# Altium schematic sheet 15_PowerSupply.SchDoc: Board power supply (part 1 of 3)
size A3; Organization: Lime Microsystems; Address1: Surrey Tech Centre; Address2: Guildford GU2 7YG; Address3: Surrey; Address4: United Kingdom; Revision: v2.1; SheetNumber: 15; SheetTotal: 15
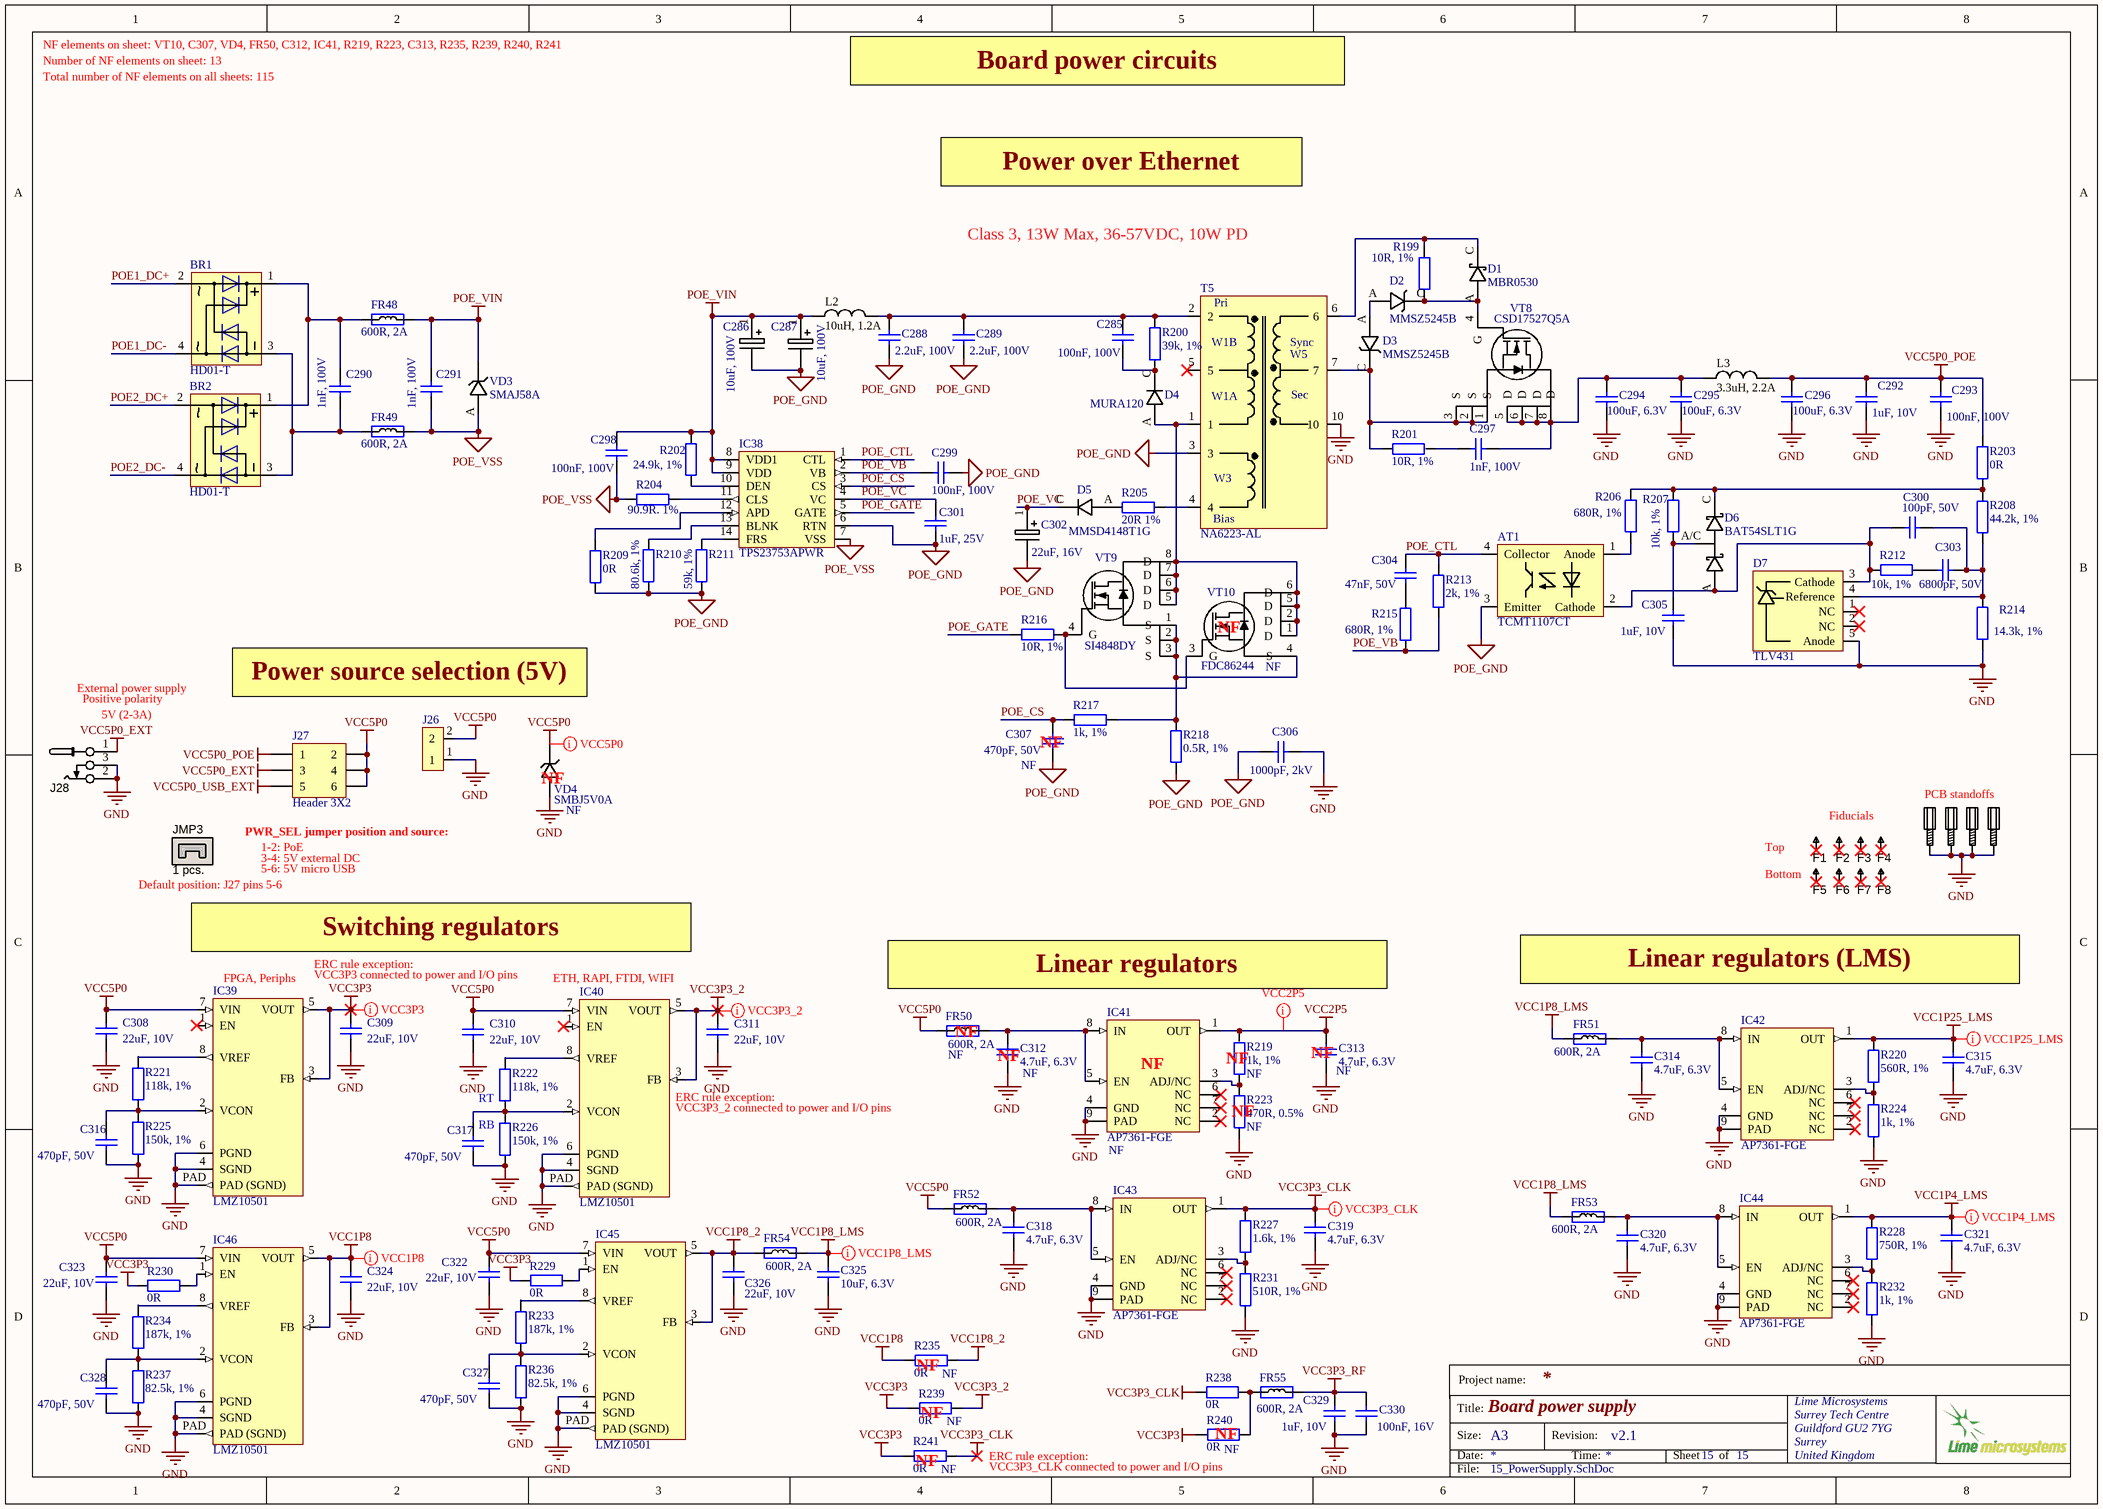
[diagram p0: 15_PowerSupply.SchDoc]

## Parts
AT1  TCMT1107CT  [TCMT1107CT_optoisolator]
BR1  HD01-T  [HD01-T _RECTIFIER_BRIDGE_v1]
BR2  HD01-T  [HD01-T _RECTIFIER_BRIDGE_v1]
C285  100nF, 100V  [CAP0603]
C286  10uF, 100V  [CAP_POL_SIZE_E]
C287  10uF, 100V  [CAP_POL_SIZE_E]
C288  2.2uF, 100V  [CAP1206]
C289  2.2uF, 100V  [CAP1206]
C290  1nF, 100V  [CAP0603]
C291  1nF, 100V  [CAP0603]
C292  1uF, 10V  [CAP0402]
C293  100nF, 100V  [CAP0603]
C294  100uF, 6.3V  [CAP1210]
C295  100uF, 6.3V  [CAP1210]
C296  100uF, 6.3V  [CAP1210]
C297  1nF, 100V  [CAP0603]
C298  100nF, 100V  [CAP0603]
C299  100nF, 100V  [CAP0603]
C300  100pF, 50V  [CAP0402]
C301  1uF, 25V  [CAP0603]
C302  22uF, 16V  [CAP_POL_SIZE_B]
C303  6800pF, 50V  [CAP0402]
C304  47nF, 50V  [CAP0603]
C305  1uF, 10V  [CAP0402]
C306  1000pF, 2kV  [CAP1812]
C307  470pF, 50V  Assembly Info: NF  [CAP0402]
C308  22uF, 10V  [CAP0603]
C309  22uF, 10V  [CAP0603]
C310  22uF, 10V  [CAP0603]
C311  22uF, 10V  [CAP0603]
C312  4.7uF, 6.3V  Assembly Info: NF  [CAP0402]
C313  4.7uF, 6.3V  Assembly Info: NF  [CAP0402]
C314  4.7uF, 6.3V  [CAP0402]
C315  4.7uF, 6.3V  [CAP0402]
C316  470pF, 50V  [CAP0402]
C317  470pF, 50V  [CAP0402]
C318  4.7uF, 6.3V  [CAP0402]
C319  4.7uF, 6.3V  [CAP0402]
C320  4.7uF, 6.3V  [CAP0402]
C321  4.7uF, 6.3V  [CAP0402]
C322  22uF, 10V  [CAP0603]
C323  22uF, 10V  [CAP0603]
C324  22uF, 10V  [CAP0603]
C325  10uF, 6.3V  [CAP0603]
C326  22uF, 10V  [CAP0603]
C327  470pF, 50V  [CAP0402]
C328  470pF, 50V  [CAP0402]
C329  1uF, 10V  [CAP0402]
C330  100nF, 16V  [CAP0402]
D1  MBR0530  [MBR0530T1G_shottky_diode_SOD123]
D2  MMSZ5245B  [MMSZ5245B_shottky_diode_SOD123]
D3  MMSZ5245B  [MMSZ5245B_shottky_diode_SOD123]
D4  MURA120  [MURA120T3G_diode_DO-214AC]
D5  MMSD4148T1G  [MMSD4148T1G_diode_SOD123]
D6  BAT54SLT1G  [BAT54SLT1G_SOT23-3]
D7  TLV431  [SOT23-5]
F1  Fiducial  [Fiducial]  (value not drawn)
F2  Fiducial  [Fiducial]  (value not drawn)
F3  Fiducial  [Fiducial]  (value not drawn)
F4  Fiducial  [Fiducial]  (value not drawn)
F5  Fiducial  [Fiducial]  (value not drawn)
F6  Fiducial  [Fiducial]  (value not drawn)
F7  Fiducial  [Fiducial]  (value not drawn)
F8  Fiducial  [Fiducial]  (value not drawn)
FR48  600R, 2A  [RES0805]
FR49  600R, 2A  [RES0805]
FR50  600R, 2A  Assembly Info: NF  [RES0805]
FR51  600R, 2A  [RES0805]
FR52  600R, 2A  [RES0805]
FR53  600R, 2A  [RES0805]
FR54  600R, 2A  [RES0805]
FR55  600R, 2A  [RES0805]
IC38  TPS23753APWR  [TPS23753APWR _TSSOP14]
IC39  LMZ10501  [LMZ10501]
IC40  LMZ10501  [LMZ10501]
IC41  AP7361-FGE  Assembly Info: NF  [AP7361]
IC42  AP7361-FGE  [AP7361]
IC43  AP7361-FGE  [AP7361]
IC44  AP7361-FGE  [AP7361]
IC45  LMZ10501  [LMZ10501]
IC46  LMZ10501  [LMZ10501]
J26  (no value)  [HDR_1x2]
J27  Header 3X2  [Header3x2]
J28  CONN_PWR_JACK_2.1x5.5mm  [CONN_PWR_JACK_v2]  (value not drawn)
JMP3  1 pcs.  (mechanical)
L2  10uH, 1.2A  [NRS4018T3R3MDGJ_inductor]
L3  3.3uH, 2.2A  [NRS4018T3R3MDGJ_inductor]
MECH5  # pcs.  [PCB_standoff]  (value not drawn)
MECH6  # pcs.  [PCB_standoff]  (value not drawn)
MECH7  # pcs.  [PCB_standoff]  (value not drawn)
MECH8  # pcs.  [PCB_standoff]  (value not drawn)
R199  10R, 1%  [RES0603]
R200  39k, 1%  [RES0805]
R201  10R, 1%  [RES0805]
R202  24.9k, 1%  [RES0402]
R203  0R  [RES0402]
R204  90.9R. 1%  [RES0603]
R205  20R 1%  [RES0805]
R206  680R, 1%  [RES0402]
R207  10k, 1%  [RES0402]
R208  44.2k, 1%  [RES0402]
R209  0R  [RES0402]
R210  80.6k, 1%  [RES0402]
R211  59k, 1%  [RES0402]
R212  10k, 1%  [RES0402]
R213  2k, 1%  [RES0402]
R214  14.3k, 1%  [RES0402]
R215  680R, 1%  [RES0402]
R216  10R, 1%  [RES0603]
R217  1k, 1%  [RES0402]
R218  0.5R, 1%  [RES1206]
R219  1k, 1%  Assembly Info: NF  [RES0402]
R220  560R, 1%  [RES0402]
R221  118k, 1%  [RES0402]
R222  118k, 1%  [RES0402]
R223  470R, 0.5%  Assembly Info: NF  [RES0402]
R224  1k, 1%  [RES0402]
R225  150k, 1%  [RES0402]
R226  150k, 1%  [RES0402]
R227  1.6k, 1%  [RES0402]
R228  750R, 1%  [RES0402]
R229  0R  [RES0402]
R230  0R  [RES0402]
R231  510R, 1%  [RES0402]
R232  1k, 1%  [RES0402]
R233  187k, 1%  [RES0402]
R234  187k, 1%  [RES0402]
R235  0R  Assembly Info: NF  [RES0805]
R236  82.5k, 1%  [RES0402]
R237  82.5k, 1%  [RES0402]
R238  0R  [RES0402]
R239  0R  Assembly Info: NF  [RES0805]
R240  0R  Assembly Info: NF  [RES0402]
R241  0R  Assembly Info: NF  [RES0805]
T5  NA6223-AL  [PoE13P-50L_Flyback_transformer]
VD3  SMAJ58A  [SMAJ58A_shottky_diode]
VD4  SMBJ5V0A  Assembly Info: NF  [SMAJ12CA-13-F]
VT8  CSD17527Q5A  [CSD17527Q5A_NMOS_8-VSONP]
VT9  SI4848DY  [SI4848DY_NMOS_SO8]
VT10  FDC86244  Assembly Info: NF  [SOT23-6]

## Nets
GND: C292.1 C293.1 C294.1 C295.1 C296.1 C305.1 C306.1 C308.1 C309.1 C310.1 C311.1 C312.1 C313.1 C314.1 C315.1 C316.2 C317.2 C318.1 C319.1 C320.1 C321.1 C322.1 C323.1 C324.1 C325.1 C326.1 C327.2 C328.2 C329.1 C330.2 D7.5(Anode) IC39.4(SGND) IC39.6(PGND) IC39.PAD(PAD_(SGND)) IC40.4(SGND) IC40.6(PGND) IC40.PAD(PAD_(SGND)) IC41.4(GND) IC41.9(PAD) IC42.4(GND) IC42.9(PAD) IC43.4(GND) IC43.9(PAD) IC44.4(GND) IC44.9(PAD) IC45.4(SGND) IC45.6(PGND) IC45.PAD(PAD_(SGND)) IC46.4(SGND) IC46.6(PGND) IC46.PAD(PAD_(SGND)) J26.1 J28.2 J28.3 MECH5.MH1 MECH6.MH1 MECH7.MH1 MECH8.MH1 R214.2 R223.2 R224.1 R225.1 R226.1 R231.2 R232.1 R236.1 R237.1 T5.10 VD4.A
POE_GND: AT1.3(Emitter) C286.2 C287.2 C288.1 C289.1 C299.1 C301.1 C302.2 C306.2 C307.2 IC38.6(RTN) R209.1 R210.2 R211.2 R218.2 T5.3
POE_VIN: C286.1 C287.1 C291.1 C298.2 FR48.2 IC38.8(VDD1) IC38.9(VDD) L2.1 R202.2 VD3.K
POE_VSS: C291.2 C298.1 FR49.2 IC38.7(VSS) R204.2 VD3.A
VCC1P4_LMS: C321.2 IC44.1(OUT) R228.1
VCC1P8: C324.2 IC46.3(FB) IC46.5(VOUT) R235.2
VCC1P8_2: C326.2 FR54.1 IC45.3(FB) IC45.5(VOUT) R235.1
VCC1P8_LMS: C325.2 FR51.1 FR53.1 FR54.2
VCC1P25_LMS: C315.2 IC42.1(OUT) R220.2
VCC2P5: C313.2 IC41.1(OUT) R219.2
VCC3P3: C309.2 IC39.3(FB) IC39.5(VOUT) R229.1 R230.1 R239.2 R240.2 R241.2
VCC3P3_2: C311.2 IC40.3(FB) IC40.5(VOUT) R239.1
VCC3P3_CLK: C319.2 IC43.1(OUT) R227.2 R238.1 R241.1
VCC3P3_RF: C329.2 C330.1 FR55.2
VCC5P0: C308.2 C310.2 C322.2 C323.2 FR50.1 FR52.1 IC39.7(VIN) IC40.7(VIN) IC45.7(VIN) IC46.7(VIN) J26.2 J27.2 J27.4 J27.6 VD4.K
VCC5P0_EXT: J27.3 J28.1
VCC5P0_POE: C292.2 C293.2 C296.2 J27.1 L3.2 R203.2
VCC5P0_USB_EXT: J27.5
POE1_DC+: BR1.2
POE1_DC-: BR1.4
POE2_DC+: BR2.2
POE2_DC-: BR2.4
POE_CS: C307.1 IC38.3(CS) R217.1
POE_CTL: AT1.4(Collector) C304.1 IC38.1(CTL) R213.2
POE_GATE: IC38.5(GATE) R216.2
POE_VB: C299.2 IC38.2(VB) R213.1 R215.1
POE_VC: C301.2 C302.1 D5.C IC38.4(VC)
NetAT1_1: AT1.1(Anode) R206.2
NetAT1_2: AT1.2(Cathode) C300.2 D6.A D7.3(Cathode) R212.1
NetBR1_1: BR1.1 BR2.1 C290.1 FR48.1
NetBR1_3: BR1.3 BR2.3 C290.2 FR49.1
NetC285_1: C285.1 D4.C R200.1
NetC285_2: C285.2 C288.2 C289.2 L2.2 R200.2 T5.2
NetC294_2: C294.2 C295.2 C297.1 L3.1 VT8.5(D) VT8.6(D) VT8.7(D) VT8.8(D)
NetC297_2: C297.2 R201.2
NetC300_1: C300.1 C303.1 D7.4(Reference) R208.1 R214.1
NetC303_2: C303.2 R212.2
NetC304_2: C304.2 R215.2
NetC305_2: C305.2 D6.A/C R207.2
NetC312_2: C312.2 FR50.2 IC41.5(EN) IC41.8(IN)
NetC314_2: C314.2 FR51.2 IC42.5(EN) IC42.8(IN)
NetC316_1: C316.1 IC39.2(VCON) R221.1 R225.2
NetC317_1: C317.1 IC40.2(VCON) R222.1 R226.2
NetC318_2: C318.2 FR52.2 IC43.5(EN) IC43.8(IN)
NetC320_2: C320.2 FR53.2 IC44.5(EN) IC44.8(IN)
NetC327_1: C327.1 IC45.2(VCON) R233.1 R236.2
NetC328_1: C328.1 IC46.2(VCON) R234.1 R237.2
NetD1_A: D1.A D2.C R199.1 VT8.4(G)
NetD1_C: D1.C R199.2 T5.6
NetD2_A: D2.A D3.A
NetD3_C: D3.C R201.1 T5.7 VT8.1(S) VT8.2(S) VT8.3(S)
NetD4_A: D4.A T5.1 VT9.5(D) VT9.6(D) VT9.7(D) VT9.8(D) VT10.1(D) VT10.2(D) VT10.5(D) VT10.6(D)
NetD5_A: D5.A R205.1
NetD6_C: D6.C R203.1 R206.1 R207.1 R208.2
NetFR55_1: FR55.1 R238.2 R240.1
NetIC38_10: IC38.10(DEN) R202.1
NetIC38_11: IC38.11(CLS) R204.1
NetIC38_12: IC38.12(APD) R209.2
NetIC38_13: IC38.13(BLNK) R210.1
NetIC38_14: IC38.14(FRS) R211.1
NetIC39_8: IC39.8(VREF) R221.2
NetIC40_8: IC40.8(VREF) R222.2
NetIC41_3: IC41.3(ADJ/NC) R219.1 R223.1
NetIC42_3: IC42.3(ADJ/NC) R220.1 R224.2
NetIC43_3: IC43.3(ADJ/NC) R227.1 R231.1
NetIC44_3: IC44.3(ADJ/NC) R228.2 R232.2
NetIC45_1: IC45.1(EN) R229.2
NetIC45_8: IC45.8(VREF) R233.2
NetIC46_1: IC46.1(EN) R230.2
NetIC46_8: IC46.8(VREF) R234.2
NetR205_2: R205.2 T5.4
NetR216_1: R216.1 VT9.4(G) VT10.3(G)
NetR217_2: R217.2 R218.1 VT9.1(S) VT9.2(S) VT9.3(S) VT10.4(S)

Not connected (* = marked no-connect by the designer): D7 1(NC)* 2(NC)*; F1 1*; F2 1*; F3 1*; F4 1*; F5 1*; F6 1*; F7 1*; F8 1*; IC39 1(EN)*; IC40 1(EN)*; IC41 2(NC)* 6(NC)* 7(NC)*; IC42 2(NC)* 6(NC)* 7(NC)*; IC43 2(NC)* 6(NC)* 7(NC)*; IC44 2(NC)* 6(NC)* 7(NC)*; JMP3 1 2; T5 5*

## Layout directives
net class VCC1P4_LMS: VCC1P4_LMS
net class VCC1P25_LMS: VCC1P25_LMS
net class VCC3P3_CLK: VCC3P3_CLK
net class VCC2P5: VCC2P5
net class VCC3P3_2: VCC3P3_2
net class VCC3P3: VCC3P3
net class VCC1P8: VCC1P8
net class VCC5P0: VCC5P0
net class VCC1P8_LMS: VCC1P8_LMS

## Notes on the sheet
- NF elements on sheet: VT10, C307, VD4, FR50, C312, IC41, R219, R223, C313, R235, R239, R240, R241
- Number of NF elements on sheet: 13
- Total number of NF elements on all sheets: 115
- Board power circuits
- Power over Ethernet
- Class 3, 13W Max, 36-57VDC, 10W PD
- IEEE 802.3-2005 compliant
- 5V, 2A
- (near IC38) 250kHz
- (near VT10) NF
- External power supply
- (near J28) Positive polarity
- (near J28) 5V (2-3A)
- Power source selection (5V)
- (near VD4) NF
- (near C307) NF
- PWR_SEL jumper position and source:
- 1-2: PoE
- Top
- Fiducials
- PCB standoffs
- (near JMP3) Default position: J27 pins 5-6
- 3-4: 5V external DC
- 5-6: 5V micro USB
- (near F5) Bottom
- Switching regulators
- (near IC39) FPGA, Periphs
- ERC rule exception:
- VCC3P3 connected to power and I/O pins
- (near IC40) ETH, RAPI, FTDI, WIFI
- Linear regulators
- Linear regulators (LMS)
- (near FR50) NF
- (near C313) NF
- RT
- (near IC40) ERC rule exception:
- (near IC40) VCC3P3_2 connected to power and I/O pins
- (near C312) NF
- (near IC41) NF
- (near R219) NF
- (near R223) NF
- (near C317) RB
- (near R235) NF
- (near R241) NF
- (near R239) NF
- (near R240) NF
- VCC3P3_CLK connected to power and I/O pins
- Project name:
- Title:
- Size:
- Date:
- A3
- Revision:
- Time:
- Sheet
- of
- File:
- (in symbol NA6223-AL_Flyback_transformer) Pri; W1B; Sync; W5; W1A; Sec; W3; Bias